# EAGLE design W025A (EAGLE 6.6.0)
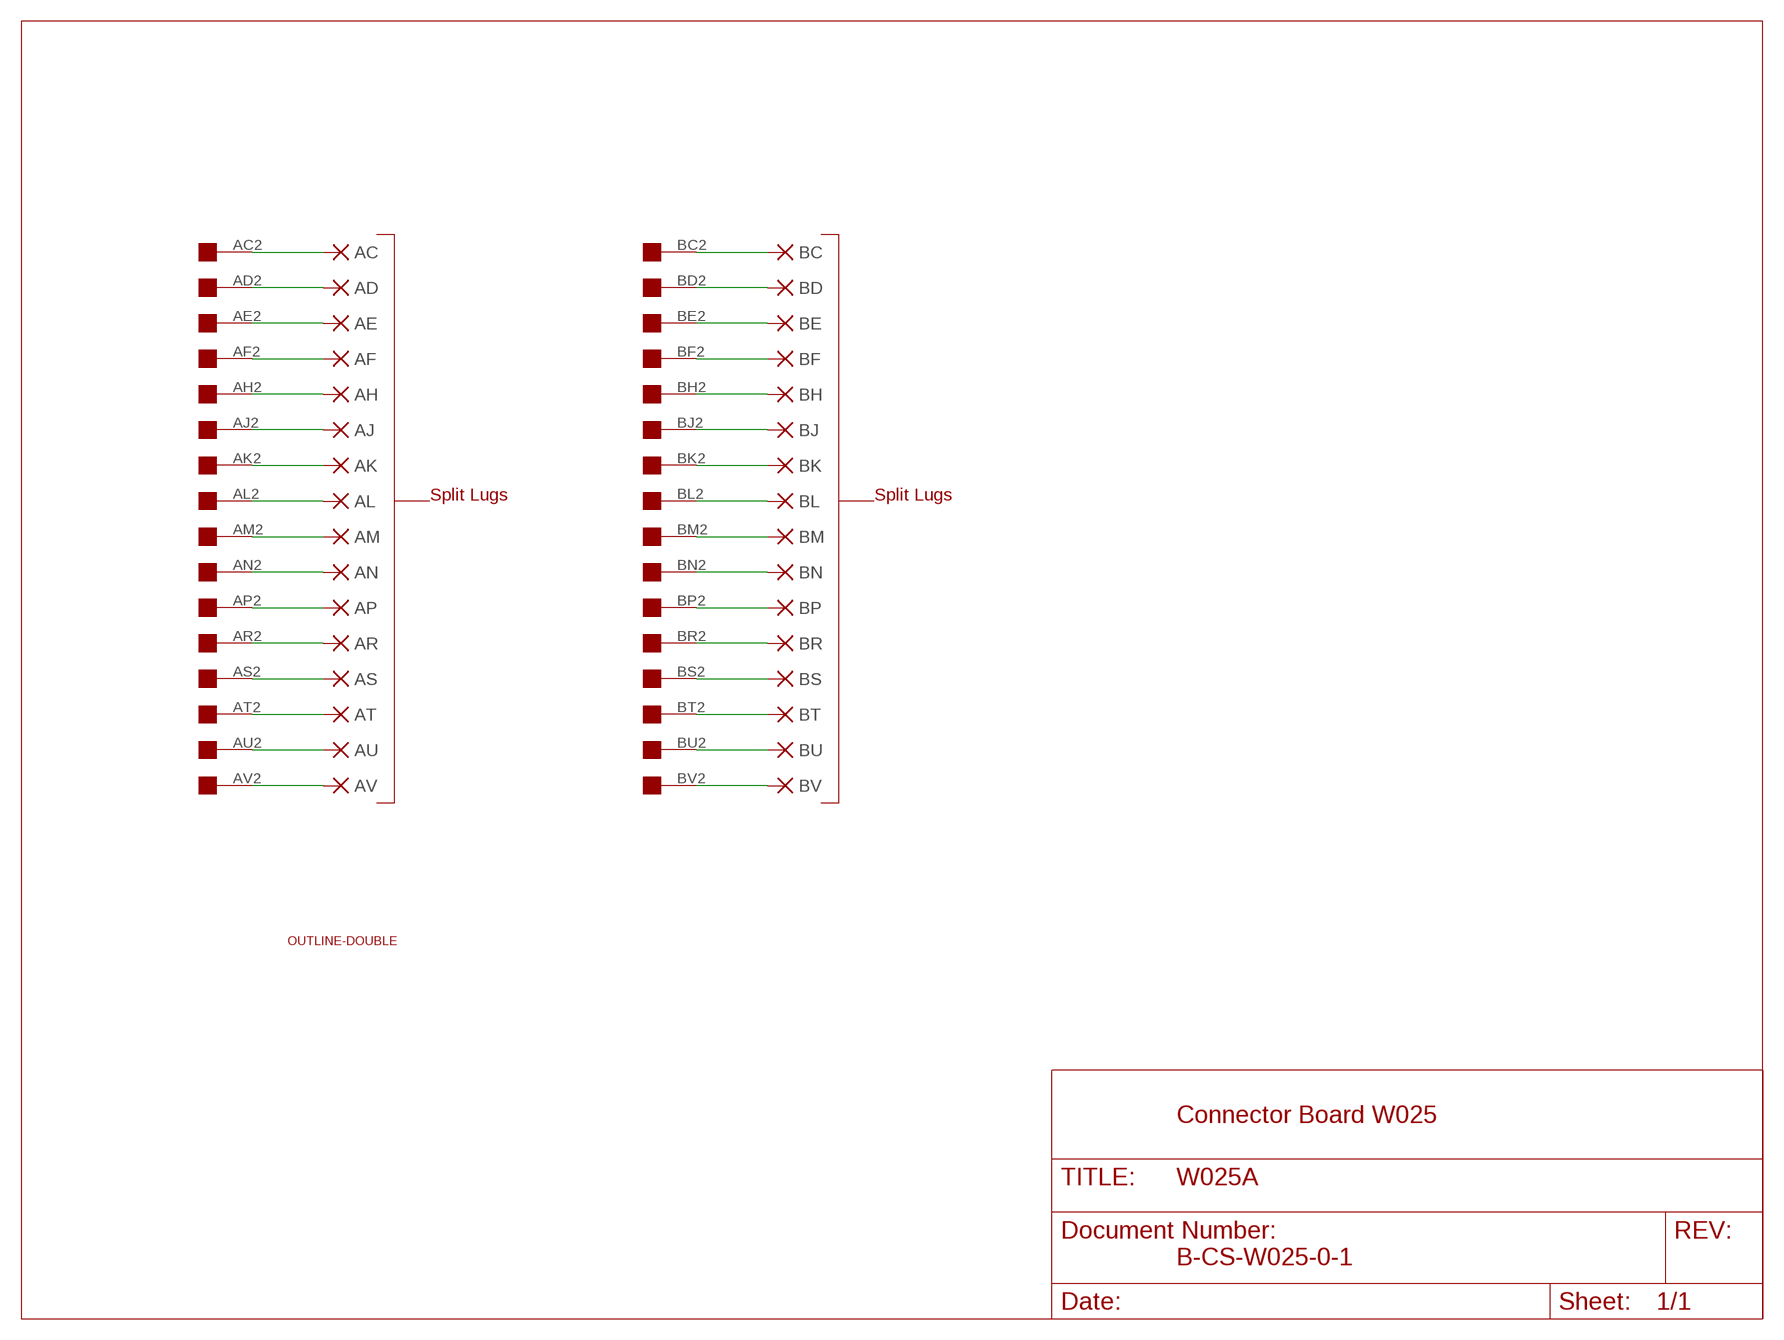
[diagram p0: schematic, sheet 1]

## Parts
AC  PAD-0465  [0465]
AD  PAD-0465  [0465]
AE  PAD-0465  [0465]
AF  PAD-0465  [0465]
AH  PAD-0465  [0465]
AJ  PAD-0465  [0465]
AK  PAD-0465  [0465]
AL  PAD-0465  [0465]
AM  PAD-0465  [0465]
AN  PAD-0465  [0465]
AP  PAD-0465  [0465]
AR  PAD-0465  [0465]
AS  PAD-0465  [0465]
AT  PAD-0465  [0465]
AU  PAD-0465  [0465]
AV  PAD-0465  [0465]
BC  PAD-0465  [0465]
BD  PAD-0465  [0465]
BE  PAD-0465  [0465]
BF  PAD-0465  [0465]
BH  PAD-0465  [0465]
BJ  PAD-0465  [0465]
BK  PAD-0465  [0465]
BL  PAD-0465  [0465]
BM  PAD-0465  [0465]
BN  PAD-0465  [0465]
BP  PAD-0465  [0465]
BR  PAD-0465  [0465]
BS  PAD-0465  [0465]
BT  PAD-0465  [0465]
BU  PAD-0465  [0465]
BV  PAD-0465  [0465]
U$1  OUTLINE-DOUBLE  [DOUBLE]
U$3  DOUBLE  [EDGE-CON4]

## Nets
N$1: BE.P$1(P) U$3.BE2
N$2: BH.P$1(P) U$3.BH2
N$3: BK.P$1(P) U$3.BK2
N$4: BM.P$1(P) U$3.BM2
N$5: BP.P$1(P) U$3.BP2
N$6: BS.P$1(P) U$3.BS2
N$7: BT.P$1(P) U$3.BT2
N$8: AE.P$1(P) U$3.AE2
N$9: BD.P$1(P) U$3.BD2
N$12: BV.P$1(P) U$3.BV2
N$13: BC.P$1(P) U$3.BC2
N$14: AH.P$1(P) U$3.AH2
N$15: BF.P$1(P) U$3.BF2
N$16: BJ.P$1(P) U$3.BJ2
N$17: BL.P$1(P) U$3.BL2
N$18: BN.P$1(P) U$3.BN2
N$19: BR.P$1(P) U$3.BR2
N$20: BU.P$1(P) U$3.BU2
N$21: AK.P$1(P) U$3.AK2
N$22: AM.P$1(P) U$3.AM2
N$23: AP.P$1(P) U$3.AP2
N$24: AS.P$1(P) U$3.AS2
N$25: AT.P$1(P) U$3.AT2
N$26: AD.P$1(P) U$3.AD2
N$29: AF.P$1(P) U$3.AF2
N$30: AJ.P$1(P) U$3.AJ2
N$31: AL.P$1(P) U$3.AL2
N$32: AN.P$1(P) U$3.AN2
N$33: AR.P$1(P) U$3.AR2
N$34: AU.P$1(P) U$3.AU2
N$35: AV.P$1(P) U$3.AV2
N$36: AC.P$1(P) U$3.AC2
Unconnected: U$3.AA1 U$3.AA2 U$3.AB1 U$3.AB2 U$3.AC1 U$3.AD1 U$3.AE1 U$3.AF1 U$3.AH1 U$3.AJ1 U$3.AK1 U$3.AL1 U$3.AM1 U$3.AN1 U$3.AP1 U$3.AR1 U$3.AS1 U$3.AT1 U$3.AU1 U$3.AV1 U$3.BA1 U$3.BA2 U$3.BB1 U$3.BB2 U$3.BC1 U$3.BD1 U$3.BE1 U$3.BF1 U$3.BH1 U$3.BJ1 U$3.BK1 U$3.BL1 U$3.BM1 U$3.BN1 U$3.BP1 U$3.BR1 U$3.BS1 U$3.BT1 U$3.BU1 U$3.BV1

## Notes on the sheet
- Split Lugs | Split Lugs
- Connector Board W025
- B-CS-W025-0-1

## Library data of the parts
AC AD AE AF AH AJ AK AL AM AN AP AR AS AT AU AV BC BD BE BF BH BJ BK BL BM BN BP BR BS BT BU BV = dpads:PAD: WIRE PAD Standard US Drill Sizes
U$1 = dec-con:OUTLINE-*: Board outlines for DEC boards.
U$3 = dec-con:DOUBLE: Double-Height DEC board

## Net classes
1 Supply: width 0.813 mm

## Board
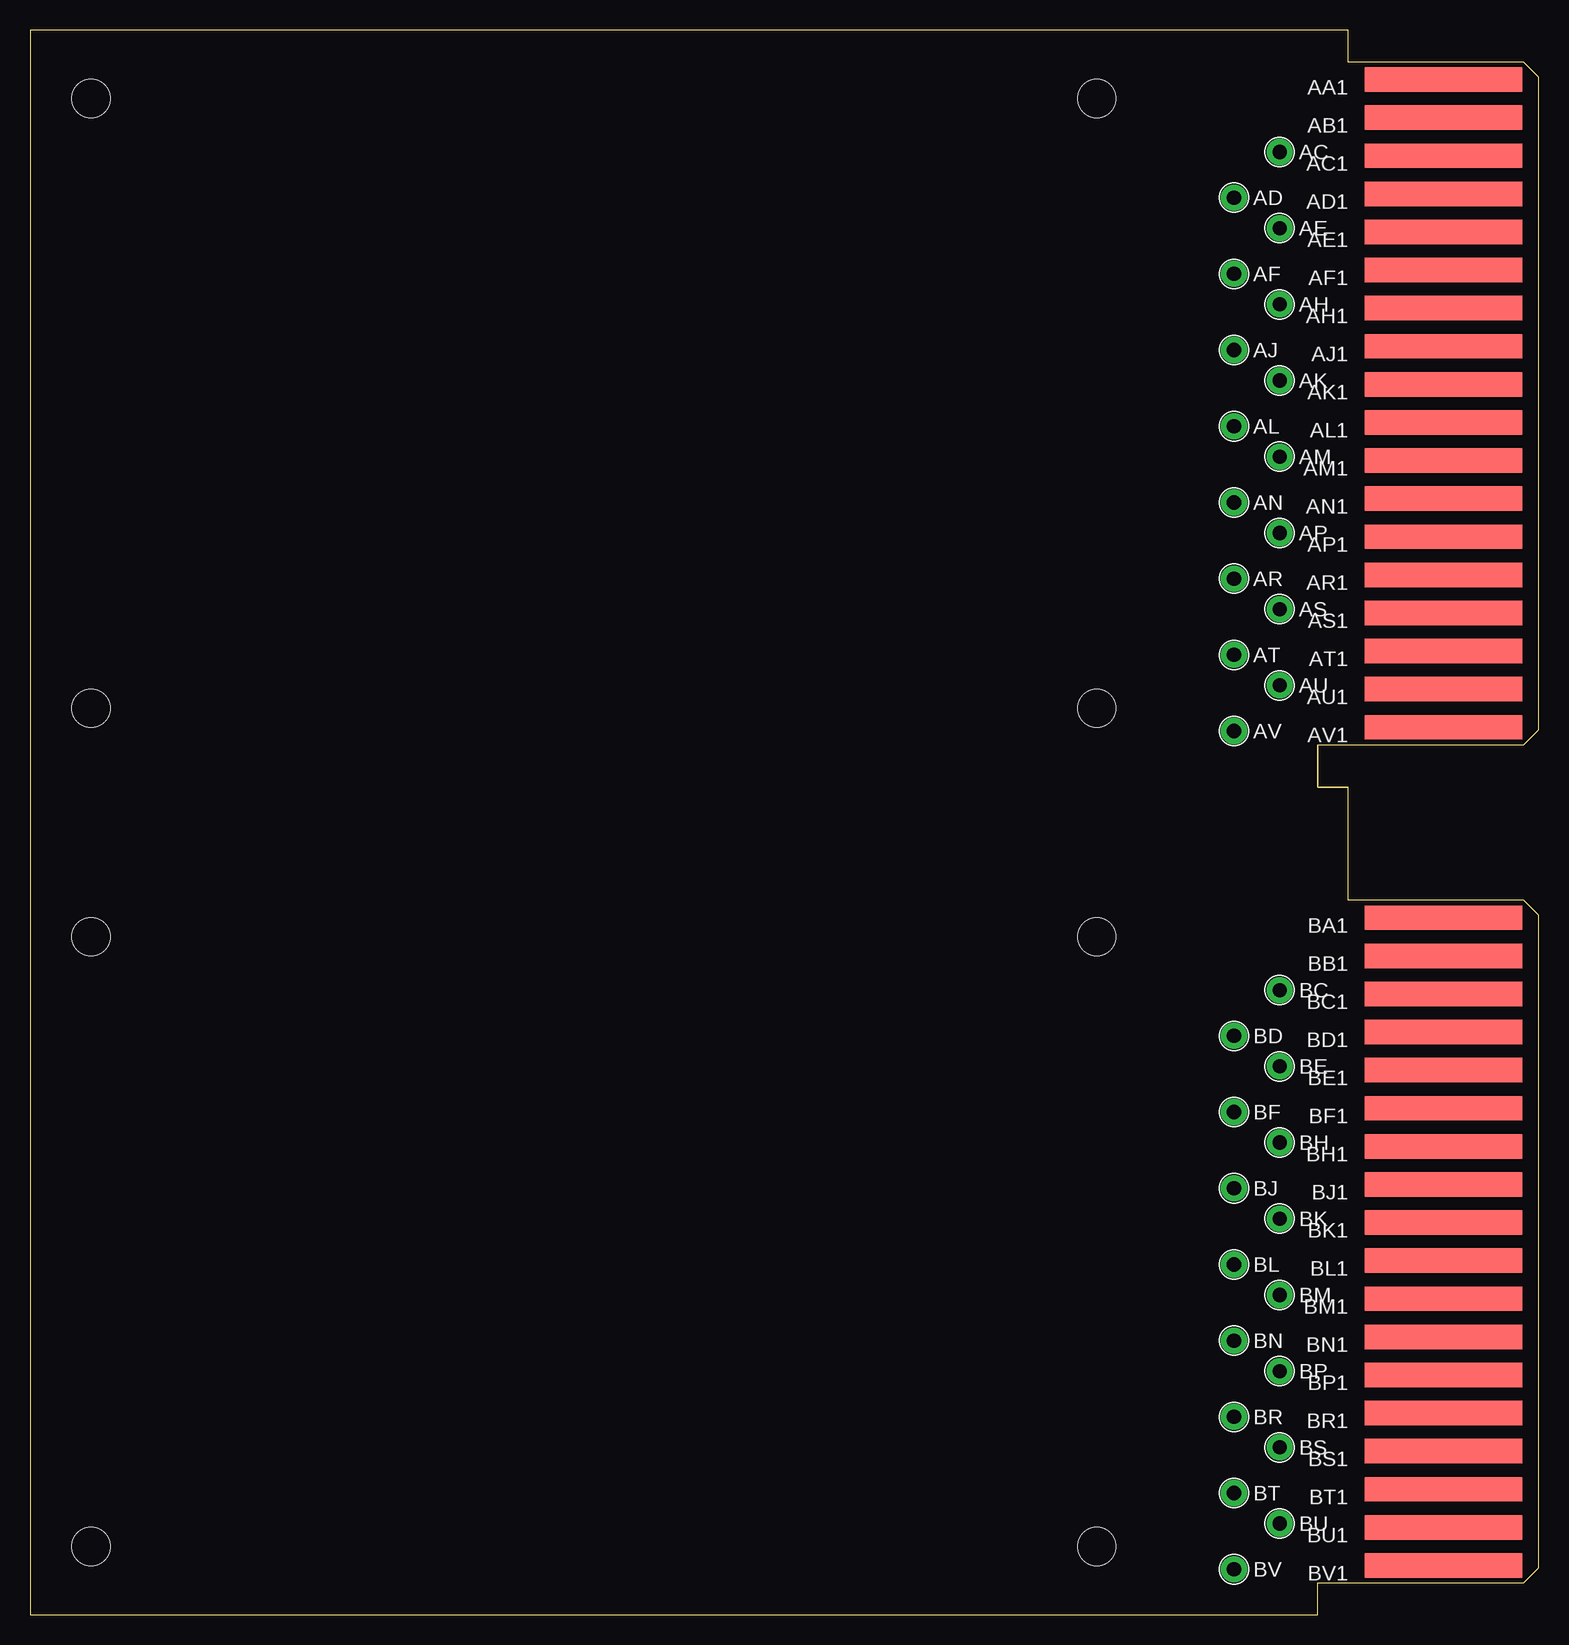
[diagram p1: board, top side]
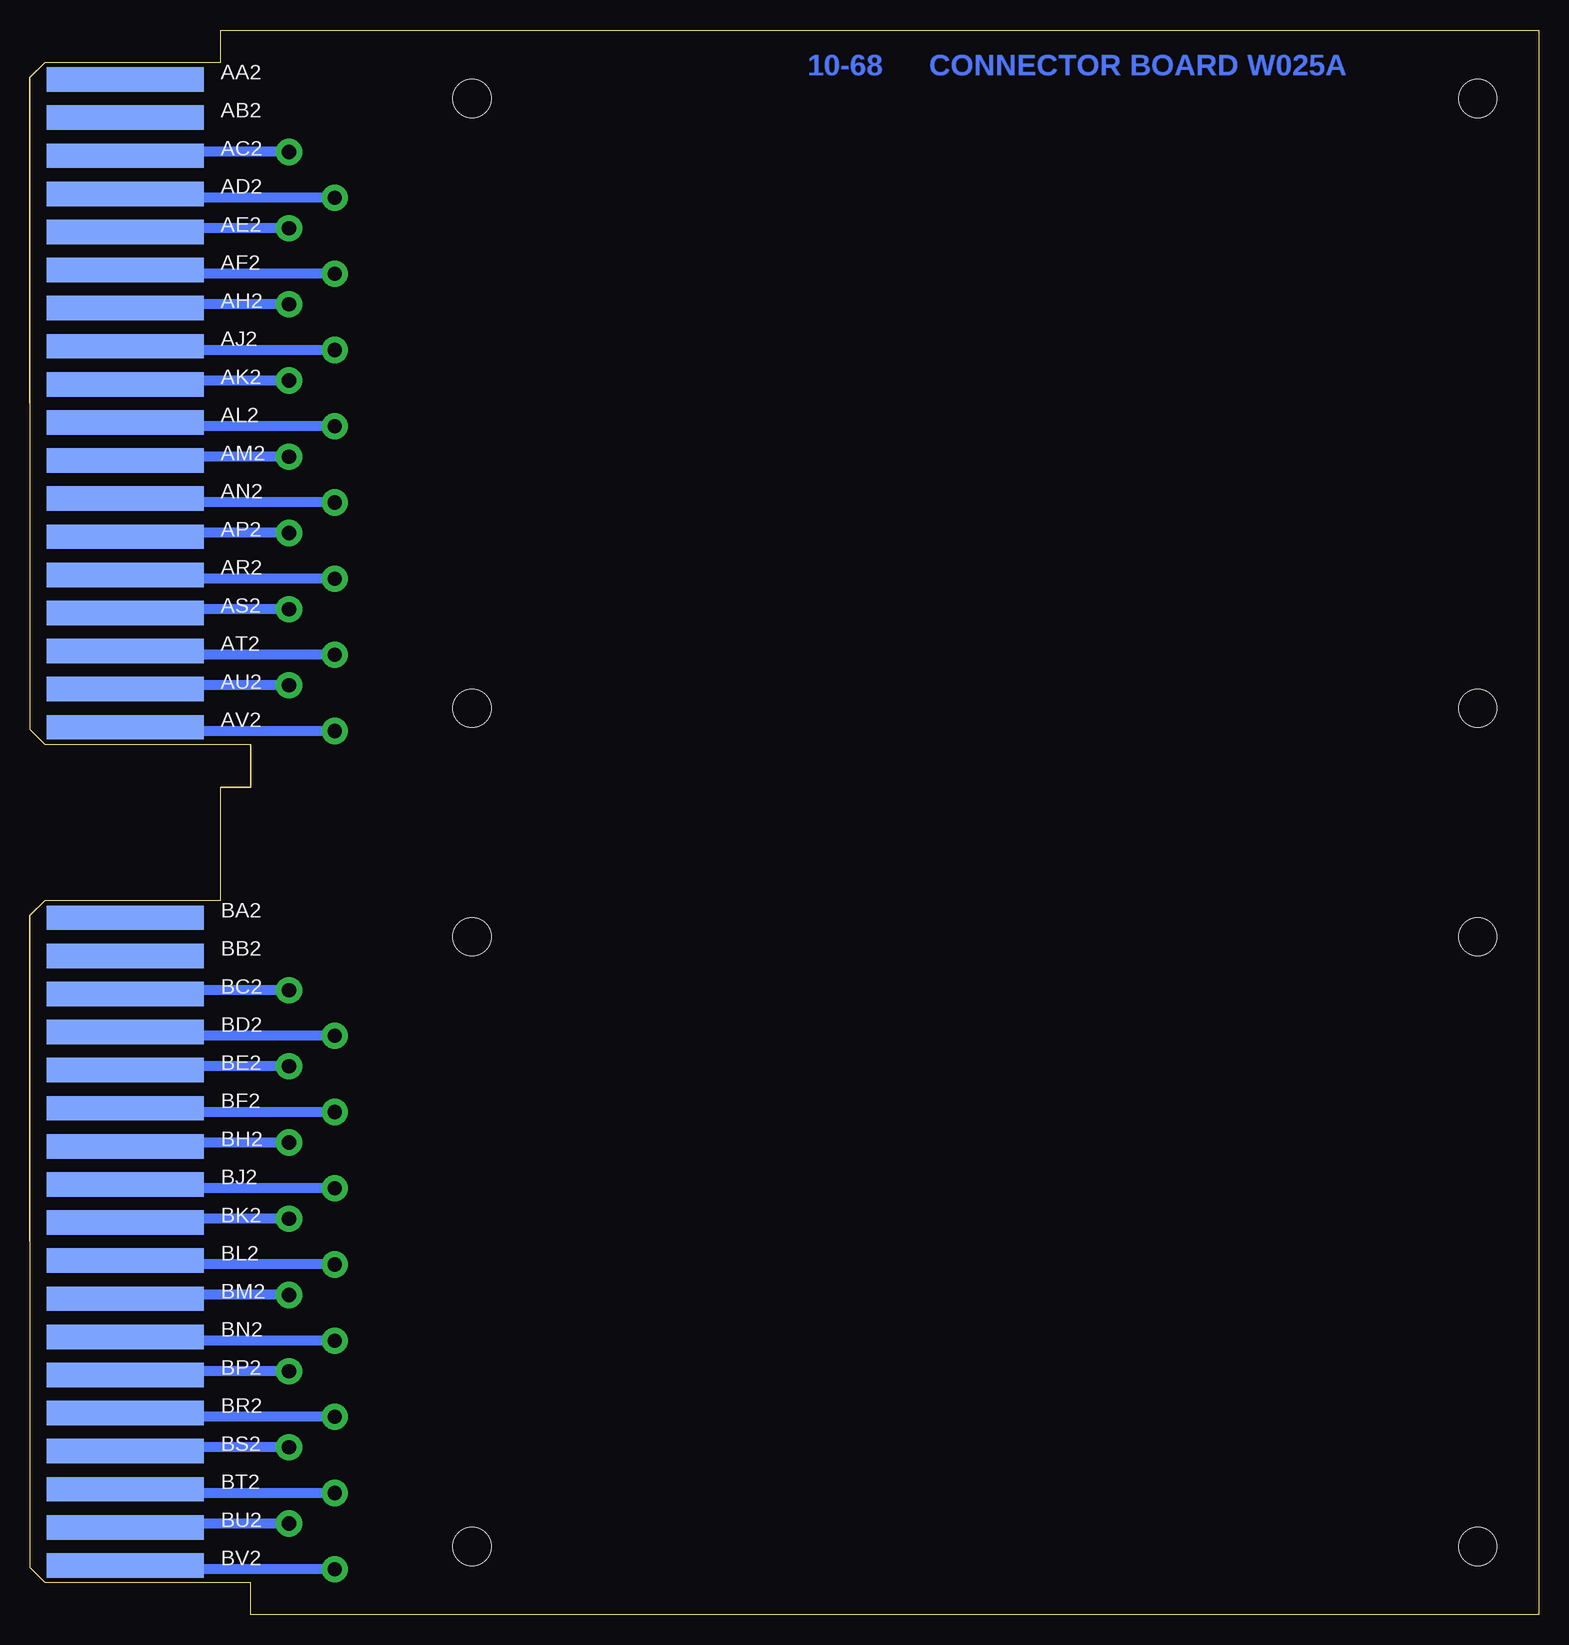
[diagram p2: board, bottom side, seen from below]

Size 125.73 x 132.08 mm. Coordinates in mm from the lower left corner, seen from the top.
Copper layers (1+16): Top 0.035mm / dielectric 1.5mm / Bottom 0.035mm
Design rules "16mils": minimum track width 16mil, minimum drill 32mil, track to track 15mil, track to pad 10mil, pad to pad 10mil, via to via 10mil, smd to smd 10mil, copper to edge 13mil, drill to drill 10mil, minimum pad ring 10mil, minimum via ring 8mil, stop-mask expansion 0mil, vias tented up to drill 0mil, thermal gap 10mil
Holes 3.17 mm at 88.9,126.36 88.9,5.71 88.9,56.52 88.9,75.56

### Footprints (pad centres in the part's own frame; a part is rotated, then mirrored left to right if it is on the bottom)
0465 = drill 1.181 pad 2.184: P$1 0,0
DOUBLE = hole 3.175: 120.65,56.515; 120.65,5.715; 120.65,75.565; 120.65,126.365
EDGE-CON4 = smd 13.106 x 2.032: AA1 7.938,4.128; AB1 7.938,7.303; AC1 7.938,10.477; AD1 7.938,13.652; AE1 7.938,16.828; AF1 7.938,20.003; AH1 7.938,23.177; AJ1 7.938,26.352; AK1 7.938,29.527; AL1 7.938,32.703; AM1 7.938,35.877; AN1 7.938,39.053; AP1 7.938,42.227; AR1 7.938,45.403; AS1 7.938,48.578; AT1 7.938,51.752; AU1 7.938,54.928; AV1 7.938,58.102; BA1 7.938,73.978; BB1 7.938,77.153; BC1 7.938,80.328; BD1 7.938,83.502; BE1 7.938,86.677; BF1 7.938,89.853; BH1 7.938,93.028; BJ1 7.938,96.203; BK1 7.938,99.377; BL1 7.938,102.552; BM1 7.938,105.728; BN1 7.938,108.903; BP1 7.938,112.078; BR1 7.938,115.252; BS1 7.938,118.427; BT1 7.938,121.603; BU1 7.938,124.778; BV1 7.938,127.953 | smd 13.106 x 2.032 bottom: AA2 7.938,4.128; AB2 7.938,7.303; AC2 7.938,10.477; AD2 7.938,13.652; AE2 7.938,16.828; AF2 7.938,20.003; AH2 7.938,23.177; AJ2 7.938,26.352; AK2 7.938,29.527; AL2 7.938,32.703; AM2 7.938,35.877; AN2 7.938,39.053; AP2 7.938,42.227; AR2 7.938,45.403; AS2 7.938,48.578; AT2 7.938,51.752; AU2 7.938,54.928; AV2 7.938,58.102; BA2 7.938,73.978; BB2 7.938,77.153; BC2 7.938,80.328; BD2 7.938,83.502; BE2 7.938,86.677; BF2 7.938,89.853; BH2 7.938,93.028; BJ2 7.938,96.203; BK2 7.938,99.377; BL2 7.938,102.552; BM2 7.938,105.728; BN2 7.938,108.903; BP2 7.938,112.078; BR2 7.938,115.252; BS2 7.938,118.427; BT2 7.938,121.603; BU2 7.938,124.778; BV2 7.938,127.953

### Placement (x,y rotation side)
AC  104.14,121.92 0 top
AD  100.33,118.11 0 top
AE  104.14,115.57 0 top
AF  100.33,111.76 0 top
AH  104.14,109.22 0 top
AJ  100.33,105.41 0 top
AK  104.14,102.87 0 top
AL  100.33,99.06 0 top
AM  104.14,96.52 0 top
AN  100.33,92.71 0 top
AP  104.14,90.17 0 top
AR  100.33,86.36 0 top
AS  104.14,83.82 0 top
AT  100.33,80.01 0 top
AU  104.14,77.47 0 top
AV  100.33,73.66 0 top
BC  104.14,52.07 0 top
BD  100.33,48.26 0 top
BE  104.14,45.72 0 top
BF  100.33,41.91 0 top
BH  104.14,39.37 0 top
BJ  100.33,35.56 0 top
BK  104.14,33.02 0 top
BL  100.33,29.21 0 top
BM  104.14,26.67 0 top
BN  100.33,22.86 0 top
BP  104.14,20.32 0 top
BR  100.33,16.51 0 top
BS  104.14,13.97 0 top
BT  100.33,10.16 0 top
BU  104.14,7.62 0 top
BV  100.33,3.81 0 top
U$1  125.73,132.08 180 top
U$3  125.73,132.08 180 top

### Tracks (layer width: path | path; a pad name or v marks a point on that pad's centre or on a via)
N$1
  Bottom 0.813: BE.P$1 116.84,45.72 117.17,45.39 U$3.BE2
N$2
  Bottom 0.813: BH.P$1 116.84,39.37 117.17,39.04 U$3.BH2
N$3
  Bottom 0.813: BK.P$1 116.84,33.02 117.14,32.72 U$3.BK2
N$4
  Bottom 0.813: BM.P$1 116.84,26.67 117.17,26.34 U$3.BM2
N$5
  Bottom 0.813: BP.P$1 116.84,20.32 117.17,19.99 U$3.BP2
N$6
  Bottom 0.813: BS.P$1 116.84,13.97 116.84,13.66 U$3.BS2
N$7
  Bottom 0.813: BT.P$1 116.84,10.16 116.84,10.49 U$3.BT2
N$8
  Bottom 0.813: U$3.AE2 115.57,115.24 115.57,115.57 AE.P$1
N$9
  Bottom 0.813: BD.P$1 116.84,48.26 117.14,48.56 U$3.BD2
N$12
  Bottom 0.813: BV.P$1 116.84,3.81 116.84,4.2 U$3.BV2
N$13
  Bottom 0.813: 116.84,52.07 116.84,51.74 | BC.P$1 116.84,52.07 | U$3.BC2 117.17,51.74 116.84,52.07
N$14
  Bottom 0.813: U$3.AH2 116.84,108.89 116.84,109.22 AH.P$1
N$15
  Bottom 0.813: BF.P$1 116.84,41.91 117.12,42.19 U$3.BF2
N$16
  Bottom 0.813: BJ.P$1 116.84,35.56 117.17,35.89 U$3.BJ2
N$17
  Bottom 0.813: BL.P$1 116.84,29.21 117.17,29.54 U$3.BL2
N$18
  Bottom 0.813: BN.P$1 116.84,22.86 117.17,23.19 U$3.BN2
N$19
  Bottom 0.813: BR.P$1 116.84,16.51 116.84,16.84 U$3.BR2
N$20
  Bottom 0.813: BU.P$1 116.84,7.62 116.84,7.26 U$3.BU2
N$21
  Bottom 0.813: U$3.AK2 116.84,102.56 116.84,102.87 AK.P$1
N$22
  Bottom 0.813: U$3.AM2 116.84,96.19 116.84,96.52 AM.P$1
N$23
  Bottom 0.813: U$3.AP2 116.84,89.84 116.84,90.17 AP.P$1
N$24
  Bottom 0.813: U$3.AS2 116.84,83.52 116.84,83.82 AS.P$1
N$25
  Bottom 0.813: U$3.AT2 115.57,80.34 115.57,80.01 AT.P$1
N$26
  Bottom 0.813: U$3.AD2 116.84,118.42 116.84,118.11 AD.P$1
N$29
  Bottom 0.813: U$3.AF2 116.84,112.04 116.84,111.76 AF.P$1
N$30
  Bottom 0.813: U$3.AJ2 116.84,105.74 116.84,105.41 AJ.P$1
N$31
  Bottom 0.813: U$3.AL2 116.84,99.39 116.84,99.06 AL.P$1
N$32
  Bottom 0.813: U$3.AN2 116.84,93.04 116.84,92.71 AN.P$1
N$33
  Bottom 0.813: U$3.AR2 116.84,86.69 116.84,86.36 AR.P$1
N$34
  Bottom 0.813: U$3.AU2 116.84,77.11 116.84,77.47 AU.P$1
N$35
  Bottom 0.813: U$3.AV2 116.84,74.05 116.84,73.66 AV.P$1
N$36
  Bottom 0.813: U$3.AC2 116.84,121.59 116.84,121.92 AC.P$1

### Text on the board
Bottom: CONNECTOR BOARD W025A | 10-68